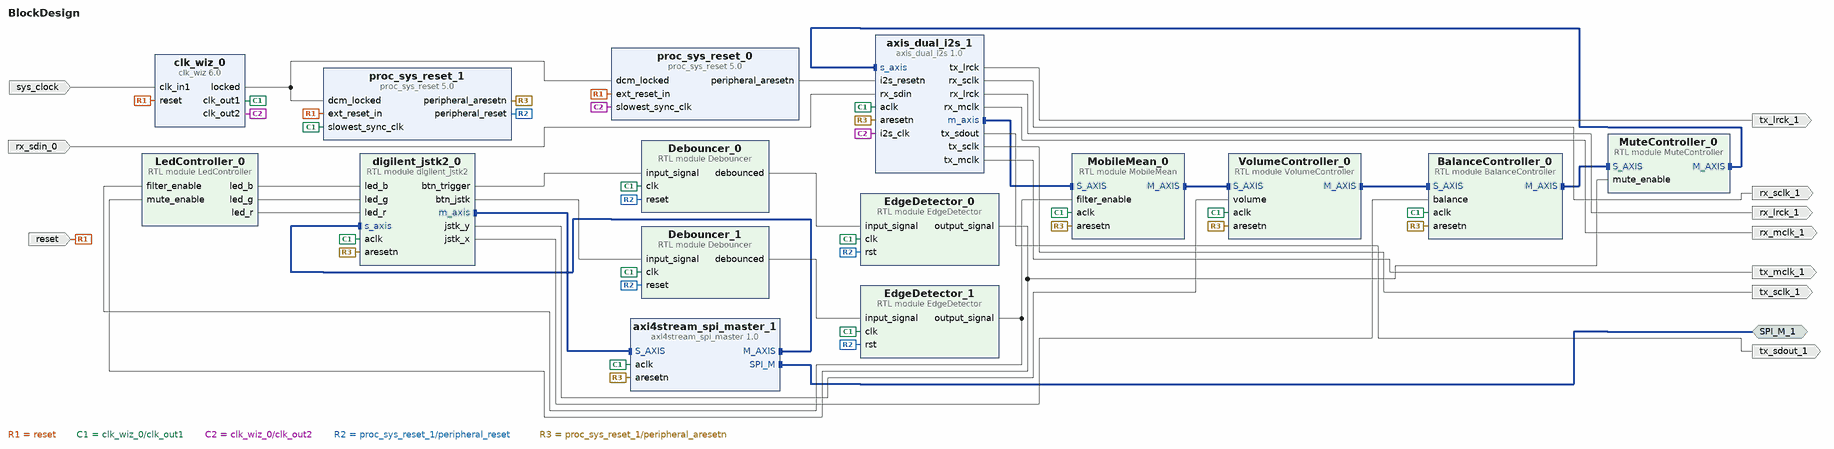
[diagram p0: block diagram of the top level]
# Vivado block design BlockDesign, xc7a35tcpg236-1, Vivado 2020.2
create_bd_design BlockDesign

create_bd_intf_port -mode Master -vlnv xilinx.com:interface:spi_rtl:1.0 SPI_M_1
create_bd_port -dir I -type clk sys_clock
set_property -dict {CONFIG.FREQ_HZ 100000000 CONFIG.PHASE 0.000} [get_bd_ports sys_clock]
create_bd_port -dir I -type rst reset
set_property -dict {CONFIG.POLARITY ACTIVE_HIGH} [get_bd_ports reset]
create_bd_port -dir I rx_sdin_0
create_bd_port -dir O tx_lrck_1
create_bd_port -dir O rx_sclk_1
create_bd_port -dir O rx_lrck_1
create_bd_port -dir O rx_mclk_1
create_bd_port -dir O tx_sdout_1
create_bd_port -dir O tx_sclk_1
create_bd_port -dir O tx_mclk_1

create_bd_cell -type ip -vlnv xilinx.com:ip:clk_wiz:6.0 clk_wiz_0
set_property -dict [list \
  CONFIG.CLKOUT1_DRIVES BUFG \
  CONFIG.CLKOUT1_JITTER 149.337 \
  CONFIG.CLKOUT1_PHASE_ERROR 122.577 \
  CONFIG.CLKOUT1_REQUESTED_OUT_FREQ 100 \
  CONFIG.CLKOUT2_DRIVES BUFG \
  CONFIG.CLKOUT2_JITTER 201.826 \
  CONFIG.CLKOUT2_PHASE_ERROR 122.577 \
  CONFIG.CLKOUT2_REQUESTED_OUT_FREQ 22.579 \
  CONFIG.CLKOUT2_USED true \
  CONFIG.CLKOUT3_DRIVES BUFG \
  CONFIG.CLKOUT4_DRIVES BUFG \
  CONFIG.CLKOUT5_DRIVES BUFG \
  CONFIG.CLKOUT6_DRIVES BUFG \
  CONFIG.CLKOUT7_DRIVES BUFG \
  CONFIG.CLK_IN1_BOARD_INTERFACE sys_clock \
  CONFIG.FEEDBACK_SOURCE FDBK_AUTO \
  CONFIG.MMCM_BANDWIDTH OPTIMIZED \
  CONFIG.MMCM_CLKFBOUT_MULT_F 7.000 \
  CONFIG.MMCM_CLKOUT0_DIVIDE_F 7.000 \
  CONFIG.MMCM_CLKOUT1_DIVIDE 31 \
  CONFIG.MMCM_COMPENSATION ZHOLD \
  CONFIG.MMCM_DIVCLK_DIVIDE 1 \
  CONFIG.NUM_OUT_CLKS 2 \
  CONFIG.PRIMITIVE MMCM \
  CONFIG.RESET_BOARD_INTERFACE reset \
  CONFIG.USE_BOARD_FLOW true \
] [get_bd_cells clk_wiz_0]
create_bd_cell -type ip -vlnv xilinx.com:ip:proc_sys_reset:5.0 proc_sys_reset_0
create_bd_cell -type ip -vlnv xilinx.com:ip:proc_sys_reset:5.0 proc_sys_reset_1
create_bd_cell -type module -reference digilent_jstk2 digilent_jstk2_0
set_property -dict {CONFIG.CLKFREQ 100000000} [get_bd_cells digilent_jstk2_0]
create_bd_cell -type ip -vlnv DigiLAB:ip:axi4stream_spi_master:1.0 axi4stream_spi_master_1
set_property -dict {CONFIG.c_clkfreq 100000000 CONFIG.c_sclkfreq 5000} [get_bd_cells axi4stream_spi_master_1]
create_bd_cell -type ip -vlnv DigiLAB:ip:axis_dual_i2s:1.0 axis_dual_i2s_1
create_bd_cell -type module -reference EdgeDetector EdgeDetector_0
create_bd_cell -type module -reference EdgeDetector EdgeDetector_1
create_bd_cell -type module -reference Debouncer Debouncer_0
set_property -dict {CONFIG.DEBOUNCE_MS 1} [get_bd_cells Debouncer_0]
create_bd_cell -type module -reference Debouncer Debouncer_1
set_property -dict {CONFIG.DEBOUNCE_MS 1} [get_bd_cells Debouncer_1]
create_bd_cell -type module -reference MuteController MuteController_0
create_bd_cell -type module -reference LedController LedController_0
create_bd_cell -type module -reference MobileMean MobileMean_0
set_property -dict {CONFIG.AVERAGING_WINDOW_SIZE 32} [get_bd_cells MobileMean_0]
create_bd_cell -type module -reference BalanceController BalanceController_0
set_property -dict {CONFIG.BALANCE_BITS 10 CONFIG.N_BALANCE 6} [get_bd_cells BalanceController_0]
create_bd_cell -type module -reference VolumeController VolumeController_0
set_property -dict {CONFIG.N_VOLUME 6} [get_bd_cells VolumeController_0]

# ---- connections ----

connect_bd_intf_net [get_bd_intf_pins MobileMean_0/M_AXIS] [get_bd_intf_pins VolumeController_0/S_AXIS]
connect_bd_intf_net [get_bd_intf_pins MuteController_0/M_AXIS] [get_bd_intf_pins axis_dual_i2s_1/s_axis]
connect_bd_intf_net [get_bd_intf_pins digilent_jstk2_0/m_axis] [get_bd_intf_pins axi4stream_spi_master_1/S_AXIS]
connect_bd_intf_net [get_bd_intf_pins axis_dual_i2s_1/m_axis] [get_bd_intf_pins MobileMean_0/S_AXIS]
connect_bd_intf_net [get_bd_intf_pins axi4stream_spi_master_1/M_AXIS] [get_bd_intf_pins digilent_jstk2_0/s_axis]
connect_bd_intf_net [get_bd_intf_pins VolumeController_0/M_AXIS] [get_bd_intf_pins BalanceController_0/S_AXIS]
connect_bd_intf_net [get_bd_intf_pins BalanceController_0/M_AXIS] [get_bd_intf_pins MuteController_0/S_AXIS]
connect_bd_intf_net [get_bd_intf_ports SPI_M_1] [get_bd_intf_pins axi4stream_spi_master_1/SPI_M]
connect_bd_net [get_bd_ports sys_clock] [get_bd_pins clk_wiz_0/clk_in1]
connect_bd_net [get_bd_ports reset] \
  [get_bd_pins clk_wiz_0/reset] [get_bd_pins proc_sys_reset_0/ext_reset_in] [get_bd_pins proc_sys_reset_1/ext_reset_in]
connect_bd_net [get_bd_pins clk_wiz_0/clk_out1] \
  [get_bd_pins proc_sys_reset_1/slowest_sync_clk] [get_bd_pins digilent_jstk2_0/aclk] \
  [get_bd_pins axi4stream_spi_master_1/aclk] [get_bd_pins axis_dual_i2s_1/aclk] [get_bd_pins EdgeDetector_0/clk] \
  [get_bd_pins EdgeDetector_1/clk] [get_bd_pins Debouncer_0/clk] [get_bd_pins Debouncer_1/clk] \
  [get_bd_pins MobileMean_0/aclk] [get_bd_pins BalanceController_0/aclk] [get_bd_pins VolumeController_0/aclk]
connect_bd_net [get_bd_pins clk_wiz_0/locked] [get_bd_pins proc_sys_reset_0/dcm_locked] [get_bd_pins proc_sys_reset_1/dcm_locked]
connect_bd_net [get_bd_pins clk_wiz_0/clk_out2] [get_bd_pins proc_sys_reset_0/slowest_sync_clk] [get_bd_pins axis_dual_i2s_1/i2s_clk]
connect_bd_net [get_bd_pins proc_sys_reset_1/peripheral_reset] \
  [get_bd_pins EdgeDetector_0/rst] [get_bd_pins EdgeDetector_1/rst] [get_bd_pins Debouncer_0/reset] \
  [get_bd_pins Debouncer_1/reset]
connect_bd_net [get_bd_pins proc_sys_reset_1/peripheral_aresetn] \
  [get_bd_pins digilent_jstk2_0/aresetn] [get_bd_pins axi4stream_spi_master_1/aresetn] [get_bd_pins axis_dual_i2s_1/aresetn] \
  [get_bd_pins MobileMean_0/aresetn] [get_bd_pins BalanceController_0/aresetn] [get_bd_pins VolumeController_0/aresetn]
connect_bd_net [get_bd_pins digilent_jstk2_0/btn_trigger] [get_bd_pins Debouncer_0/input_signal]
connect_bd_net [get_bd_pins digilent_jstk2_0/btn_jstk] [get_bd_pins Debouncer_1/input_signal]
connect_bd_net [get_bd_pins Debouncer_0/debounced] [get_bd_pins EdgeDetector_0/input_signal]
connect_bd_net [get_bd_pins Debouncer_1/debounced] [get_bd_pins EdgeDetector_1/input_signal]
connect_bd_net [get_bd_pins EdgeDetector_1/output_signal] [get_bd_pins LedController_0/filter_enable] [get_bd_pins MobileMean_0/filter_enable]
connect_bd_net [get_bd_pins axis_dual_i2s_1/tx_lrck] [get_bd_ports tx_lrck_1]
connect_bd_net [get_bd_pins axis_dual_i2s_1/rx_sclk] [get_bd_ports rx_sclk_1]
connect_bd_net [get_bd_pins axis_dual_i2s_1/rx_lrck] [get_bd_ports rx_lrck_1]
connect_bd_net [get_bd_pins axis_dual_i2s_1/rx_mclk] [get_bd_ports rx_mclk_1]
connect_bd_net [get_bd_pins axis_dual_i2s_1/tx_sdout] [get_bd_ports tx_sdout_1]
connect_bd_net [get_bd_pins axis_dual_i2s_1/tx_sclk] [get_bd_ports tx_sclk_1]
connect_bd_net [get_bd_pins axis_dual_i2s_1/tx_mclk] [get_bd_ports tx_mclk_1]
connect_bd_net [get_bd_pins EdgeDetector_0/output_signal] [get_bd_pins MuteController_0/mute_enable] [get_bd_pins LedController_0/mute_enable]
connect_bd_net [get_bd_pins LedController_0/led_b] [get_bd_pins digilent_jstk2_0/led_b]
connect_bd_net [get_bd_pins LedController_0/led_g] [get_bd_pins digilent_jstk2_0/led_g]
connect_bd_net [get_bd_pins LedController_0/led_r] [get_bd_pins digilent_jstk2_0/led_r]
connect_bd_net -net rx_sdin_0_1 [get_bd_ports rx_sdin_0] [get_bd_pins axis_dual_i2s_1/rx_sdin]
connect_bd_net [get_bd_pins proc_sys_reset_0/peripheral_aresetn] [get_bd_pins axis_dual_i2s_1/i2s_resetn]
connect_bd_net [get_bd_pins digilent_jstk2_0/jstk_x] [get_bd_pins BalanceController_0/balance]
connect_bd_net [get_bd_pins digilent_jstk2_0/jstk_y] [get_bd_pins VolumeController_0/volume]

validate_bd_design
save_bd_design
